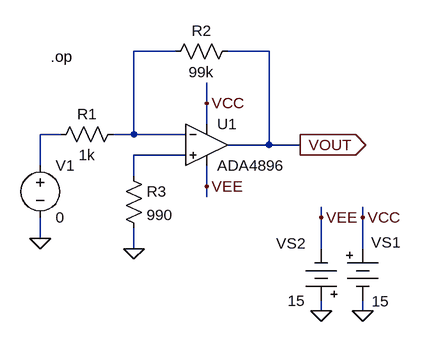
[diagram p0: schematic fig-02-01-23(b).asc]
fig-02-01-23(b).asc, the LTspice schematic file:
Version 4
SHEET 1 880 680
WIRE 160 32 96 32
WIRE 304 32 240 32
WIRE 208 112 208 80
WIRE 208 144 208 112
WIRE -16 160 -48 160
WIRE 96 160 96 32
WIRE 96 160 64 160
WIRE 176 160 96 160
WIRE 304 176 304 32
WIRE 304 176 240 176
WIRE 352 176 304 176
WIRE 176 192 96 192
WIRE -48 208 -48 160
WIRE 96 224 96 192
WIRE 208 240 208 208
WIRE 208 256 208 240
WIRE 384 288 384 272
WIRE 448 288 448 272
WIRE -48 320 -48 288
WIRE 96 336 96 304
WIRE 384 336 384 288
WIRE 448 336 448 288
WIRE 384 432 384 416
WIRE 448 432 448 416
FLAG -48 320 0
FLAG 384 432 0
FLAG 448 432 0
FLAG 384 288 VEE
FLAG 448 288 VCC
FLAG 208 112 VCC
FLAG 208 240 VEE
FLAG 352 176 VOUT
IOPIN 352 176 Out
FLAG 96 336 0
SYMBOL Misc\\battery 448 320 R0
WINDOW 0 13 6 Left 2
WINDOW 3 14 97 Left 2
SYMATTR InstName VS1
SYMATTR Value 15
SYMBOL Misc\\battery 384 432 R180
WINDOW 0 24 104 Left 2
WINDOW 3 24 16 Left 2
SYMATTR InstName VS2
SYMATTR Value 15
SYMBOL res 256 16 R90
WINDOW 0 0 56 VBottom 2
WINDOW 3 32 56 VTop 2
SYMATTR InstName R2
SYMATTR Value 99k
SYMBOL Opamps\\ADA4896 208 112 R0
SYMATTR InstName U1
SYMBOL res 80 144 R90
WINDOW 0 0 56 VBottom 2
WINDOW 3 32 56 VTop 2
SYMATTR InstName R1
SYMATTR Value 1k
SYMBOL voltage -48 192 R0
WINDOW 123 0 0 Left 0
WINDOW 39 0 0 Left 0
SYMATTR InstName V1
SYMATTR Value 0
SYMBOL res 80 208 R0
SYMATTR InstName R3
SYMATTR Value 990
TEXT -32 40 Left 2 !.op

The netlist it stands for:
* fig-02-01-23(b).asc
VS1 VCC 0 15
VS2 0 VEE 15
R2 VOUT N001 99k
XU1 N003 N001 VCC VEE VOUT ADA4896  ; pins In+ In- V+ V- OUT
R1 N001 N002 1k
V1 N002 0 0
R3 N003 0 990
.op
.backanno
.end